# EAGLE design Rear_left_lamp (EAGLE 7.3.0)
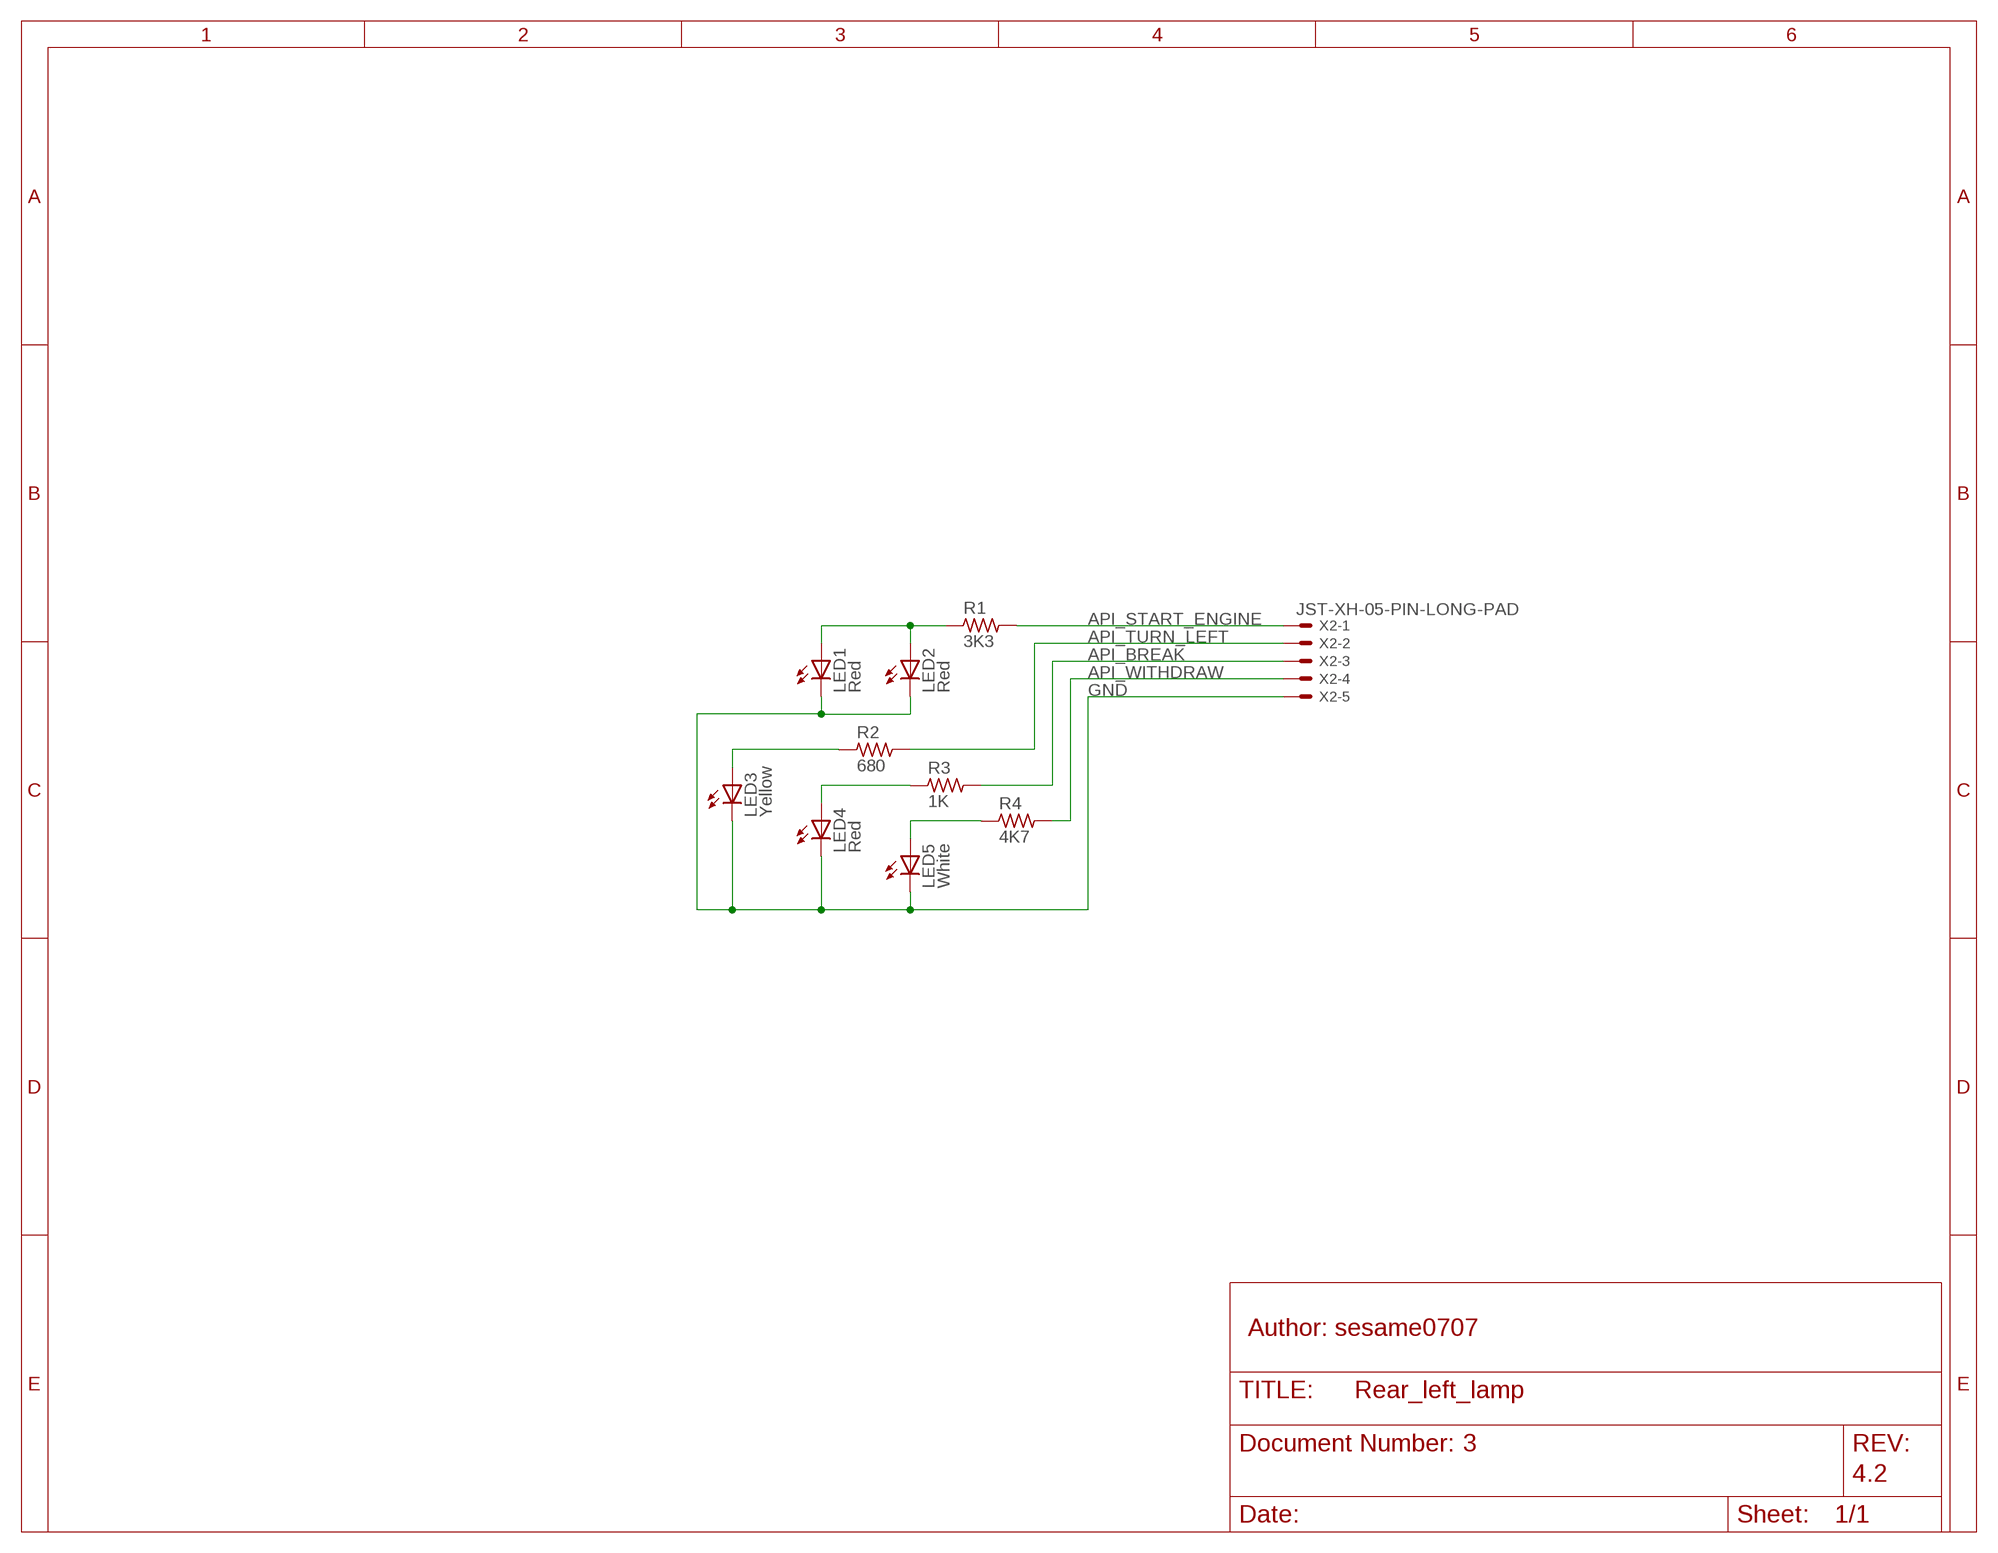
[diagram p0: schematic, sheet 1]

## Parts
LED1  Red  LED5MM  [LED5MM]
LED2  Red  LED5MM  [LED5MM]
LED3  Yellow  LED5MM  [LED5MM]
LED4  Red  LED5MM  [LED5MM]
LED5  White  LED5MM  [LED5MM]
R1  3K3  R_1206  [R1206]
R2  680  R_1206  [R1206]
R3  1K  R_1206  [R1206]
R4  4K7  R_1206  [R1206]
X2  JST-XH-05-PIN-LONG-PAD  [JST-XH-05-PACKAGE-LONG-PAD]

## Nets
API_BREAK: R3.2 X2.3
API_START_ENGINE: LED1.A LED2.A R1.1
API_TURN_LEFT: R2.2 X2.2
API_WITHDRAW: R4.2 X2.4
GND: LED1.K(C) LED2.K(C) LED3.K(C) LED4.K(C) LED5.K(C) X2.5
N$1: LED3.A R2.1
N$2: R1.2 X2.1
N$8: LED4.A R3.1
N$10: LED5.A R4.1

## Notes on the sheet
- Author: sesame0707
- 3
- 4.2

## Library data of the parts
LED1 LED2 = led:LED: LED OSRAM: - CHIPLED LG R971, LG N971, LY N971, LG Q971, LY Q971, LO R971, LY R971 LH N974, LH R974 LS Q976, LO Q976, LY Q976 LO Q996 - Hyper CHIPLED LW Q18S LB Q993, LB Q99A, LB R99A - SideLED LS A670, LO A670, LY A670, LG A670, LP A670 LB A673, LV A673, LT A673, LW A673 LH A674 LY A675 LS A676, LA A676, LO A676, LY A676, LW A676 LS A679, LY A679, LG A679 - Hyper Micro SIDELED® LS Y876, LA Y876, LO Y876, LY Y876 LT Y87S - SmartLED LW L88C, LW L88S LB L89C, LB L89S, LG L890 LS L89K, LO L89K, LY L89K LS L896, LA L896, LO L896, LY L896 - TOPLED LS T670, LO T670, LY T670, LG T670, LP T670 LSG T670, LSP T670, LSY T670, LOP T670, LYG T670 LG T671, LOG T671, LSG T671 LB T673, LV T673, LT T673, LW T673 LH T674 LS T676, LA T676, LO T676, LY T676, LB T676, LH T676, LSB T676, LW T676 LB T67C, LV T67C, LT T67C, LS T67K, LO T67K, LY T67K, LW E67C LS E67B, LA E67B, LO E67B, LY E67B, LB E67C, LV E67C, LT E67C LW T67C LS T679, LY T679, LG T679 LS T770, LO T770, LY T770, LG T770, LP T770 LB T773, LV T773, LT T773, LW T773 LH T774 LS E675, LA E675, LY E675, LS T675 LS T776, LA T776, LO T776, LY T776, LB T776 LHGB T686 LT T68C, LB T68C - Hyper Mini TOPLED® LB M676 - Mini TOPLED Santana® LG M470 LS M47K, LO M47K, LY M47K Source: http://www.osram.convergy.de LUXEON: - LUMILED® LXK2-PW12-R00, LXK2-PW12-S00, LXK2-PW14-U00, LXK2-PW14-V00 LXK2-PM12-R00, LXK2-PM12-S00, LXK2-PM14-U00 LXK2-PE12-Q00, LXK2-PE12-R00, LXK2-PE12-S00, LXK2-PE14-T00, LXK2-PE14-U00 LXK2-PB12-K00, LXK2-PB12-L00, LXK2-PB12-M00, LXK2-PB14-N00, LXK2-PB14-P00, LXK2-PB14-Q00 LXK2-PR12-L00, LXK2-PR12-M00, LXK2-PR14-Q00, LXK2-PR14-R00 LXK2-PD12-Q00, LXK2-PD12-R00, LXK2-PD12-S00 LXK2-PH12-R00, LXK2-PH12-S00 LXK2-PL12-P00, LXK2-PL12-Q00, LXK2-PL12-R00 Source: www.luxeon.com KINGBRIGHT: KA-3528ASYC Source: www.kingbright.com; COLOR: Red; CURRENT_EMPIRICAL: 0.15 mA; MANUFACTURER: LUCKYLIGHT; MANUFACTURER_PART_NUMBER: LL-503VD2E-1B; SUPPLIER: TME; SUPPLIER_PART_NUMBER: LL-503VD2E-1B; SUPPLIER_URL: https://www.tme.eu/pl/details/ll-503vd2e-1b/diody-led-tht-okragle/luckylight/; VOLTAGE_EMPIRICAL: 1.83 V
LED3 = led:LED: LED OSRAM: - CHIPLED LG R971, LG N971, LY N971, LG Q971, LY Q971, LO R971, LY R971 LH N974, LH R974 LS Q976, LO Q976, LY Q976 LO Q996 - Hyper CHIPLED LW Q18S LB Q993, LB Q99A, LB R99A - SideLED LS A670, LO A670, LY A670, LG A670, LP A670 LB A673, LV A673, LT A673, LW A673 LH A674 LY A675 LS A676, LA A676, LO A676, LY A676, LW A676 LS A679, LY A679, LG A679 - Hyper Micro SIDELED® LS Y876, LA Y876, LO Y876, LY Y876 LT Y87S - SmartLED LW L88C, LW L88S LB L89C, LB L89S, LG L890 LS L89K, LO L89K, LY L89K LS L896, LA L896, LO L896, LY L896 - TOPLED LS T670, LO T670, LY T670, LG T670, LP T670 LSG T670, LSP T670, LSY T670, LOP T670, LYG T670 LG T671, LOG T671, LSG T671 LB T673, LV T673, LT T673, LW T673 LH T674 LS T676, LA T676, LO T676, LY T676, LB T676, LH T676, LSB T676, LW T676 LB T67C, LV T67C, LT T67C, LS T67K, LO T67K, LY T67K, LW E67C LS E67B, LA E67B, LO E67B, LY E67B, LB E67C, LV E67C, LT E67C LW T67C LS T679, LY T679, LG T679 LS T770, LO T770, LY T770, LG T770, LP T770 LB T773, LV T773, LT T773, LW T773 LH T774 LS E675, LA E675, LY E675, LS T675 LS T776, LA T776, LO T776, LY T776, LB T776 LHGB T686 LT T68C, LB T68C - Hyper Mini TOPLED® LB M676 - Mini TOPLED Santana® LG M470 LS M47K, LO M47K, LY M47K Source: http://www.osram.convergy.de LUXEON: - LUMILED® LXK2-PW12-R00, LXK2-PW12-S00, LXK2-PW14-U00, LXK2-PW14-V00 LXK2-PM12-R00, LXK2-PM12-S00, LXK2-PM14-U00 LXK2-PE12-Q00, LXK2-PE12-R00, LXK2-PE12-S00, LXK2-PE14-T00, LXK2-PE14-U00 LXK2-PB12-K00, LXK2-PB12-L00, LXK2-PB12-M00, LXK2-PB14-N00, LXK2-PB14-P00, LXK2-PB14-Q00 LXK2-PR12-L00, LXK2-PR12-M00, LXK2-PR14-Q00, LXK2-PR14-R00 LXK2-PD12-Q00, LXK2-PD12-R00, LXK2-PD12-S00 LXK2-PH12-R00, LXK2-PH12-S00 LXK2-PL12-P00, LXK2-PL12-Q00, LXK2-PL12-R00 Source: www.luxeon.com KINGBRIGHT: KA-3528ASYC Source: www.kingbright.com; COLOR: Yellow; CURRENT_EMPIRICAL: 1.42 mA; MANUFACTURER: LUCKYLIGHT; MANUFACTURER_PART_NUMBER: LL-503YD2E-1B; SUPPLIER: TME; SUPPLIER_PART_NUMBER: LL-503YD2E-1B; SUPPLIER_URL: https://www.tme.eu/pl/details/ll-503yd2e-1b/diody-led-tht-okragle/luckylight/; VOLTAGE_EMPIRICAL: 1.88 V
LED4 = led:LED: LED OSRAM: - CHIPLED LG R971, LG N971, LY N971, LG Q971, LY Q971, LO R971, LY R971 LH N974, LH R974 LS Q976, LO Q976, LY Q976 LO Q996 - Hyper CHIPLED LW Q18S LB Q993, LB Q99A, LB R99A - SideLED LS A670, LO A670, LY A670, LG A670, LP A670 LB A673, LV A673, LT A673, LW A673 LH A674 LY A675 LS A676, LA A676, LO A676, LY A676, LW A676 LS A679, LY A679, LG A679 - Hyper Micro SIDELED® LS Y876, LA Y876, LO Y876, LY Y876 LT Y87S - SmartLED LW L88C, LW L88S LB L89C, LB L89S, LG L890 LS L89K, LO L89K, LY L89K LS L896, LA L896, LO L896, LY L896 - TOPLED LS T670, LO T670, LY T670, LG T670, LP T670 LSG T670, LSP T670, LSY T670, LOP T670, LYG T670 LG T671, LOG T671, LSG T671 LB T673, LV T673, LT T673, LW T673 LH T674 LS T676, LA T676, LO T676, LY T676, LB T676, LH T676, LSB T676, LW T676 LB T67C, LV T67C, LT T67C, LS T67K, LO T67K, LY T67K, LW E67C LS E67B, LA E67B, LO E67B, LY E67B, LB E67C, LV E67C, LT E67C LW T67C LS T679, LY T679, LG T679 LS T770, LO T770, LY T770, LG T770, LP T770 LB T773, LV T773, LT T773, LW T773 LH T774 LS E675, LA E675, LY E675, LS T675 LS T776, LA T776, LO T776, LY T776, LB T776 LHGB T686 LT T68C, LB T68C - Hyper Mini TOPLED® LB M676 - Mini TOPLED Santana® LG M470 LS M47K, LO M47K, LY M47K Source: http://www.osram.convergy.de LUXEON: - LUMILED® LXK2-PW12-R00, LXK2-PW12-S00, LXK2-PW14-U00, LXK2-PW14-V00 LXK2-PM12-R00, LXK2-PM12-S00, LXK2-PM14-U00 LXK2-PE12-Q00, LXK2-PE12-R00, LXK2-PE12-S00, LXK2-PE14-T00, LXK2-PE14-U00 LXK2-PB12-K00, LXK2-PB12-L00, LXK2-PB12-M00, LXK2-PB14-N00, LXK2-PB14-P00, LXK2-PB14-Q00 LXK2-PR12-L00, LXK2-PR12-M00, LXK2-PR14-Q00, LXK2-PR14-R00 LXK2-PD12-Q00, LXK2-PD12-R00, LXK2-PD12-S00 LXK2-PH12-R00, LXK2-PH12-S00 LXK2-PL12-P00, LXK2-PL12-Q00, LXK2-PL12-R00 Source: www.luxeon.com KINGBRIGHT: KA-3528ASYC Source: www.kingbright.com; COLOR: Red; CURRENT_EMPIRICAL: 1.48 mA; MANUFACTURER: LUCKYLIGHT; MANUFACTURER_PART_NUMBER: LL-503VD2E-1B; SUPPLIER: TME; SUPPLIER_PART_NUMBER: LL-503VD2E-1B; SUPPLIER_URL: https://www.tme.eu/pl/details/ll-503vd2e-1b/diody-led-tht-okragle/luckylight/; VOLTAGE_EMPIRICAL: 1.83 V
LED5 = led:LED: LED OSRAM: - CHIPLED LG R971, LG N971, LY N971, LG Q971, LY Q971, LO R971, LY R971 LH N974, LH R974 LS Q976, LO Q976, LY Q976 LO Q996 - Hyper CHIPLED LW Q18S LB Q993, LB Q99A, LB R99A - SideLED LS A670, LO A670, LY A670, LG A670, LP A670 LB A673, LV A673, LT A673, LW A673 LH A674 LY A675 LS A676, LA A676, LO A676, LY A676, LW A676 LS A679, LY A679, LG A679 - Hyper Micro SIDELED® LS Y876, LA Y876, LO Y876, LY Y876 LT Y87S - SmartLED LW L88C, LW L88S LB L89C, LB L89S, LG L890 LS L89K, LO L89K, LY L89K LS L896, LA L896, LO L896, LY L896 - TOPLED LS T670, LO T670, LY T670, LG T670, LP T670 LSG T670, LSP T670, LSY T670, LOP T670, LYG T670 LG T671, LOG T671, LSG T671 LB T673, LV T673, LT T673, LW T673 LH T674 LS T676, LA T676, LO T676, LY T676, LB T676, LH T676, LSB T676, LW T676 LB T67C, LV T67C, LT T67C, LS T67K, LO T67K, LY T67K, LW E67C LS E67B, LA E67B, LO E67B, LY E67B, LB E67C, LV E67C, LT E67C LW T67C LS T679, LY T679, LG T679 LS T770, LO T770, LY T770, LG T770, LP T770 LB T773, LV T773, LT T773, LW T773 LH T774 LS E675, LA E675, LY E675, LS T675 LS T776, LA T776, LO T776, LY T776, LB T776 LHGB T686 LT T68C, LB T68C - Hyper Mini TOPLED® LB M676 - Mini TOPLED Santana® LG M470 LS M47K, LO M47K, LY M47K Source: http://www.osram.convergy.de LUXEON: - LUMILED® LXK2-PW12-R00, LXK2-PW12-S00, LXK2-PW14-U00, LXK2-PW14-V00 LXK2-PM12-R00, LXK2-PM12-S00, LXK2-PM14-U00 LXK2-PE12-Q00, LXK2-PE12-R00, LXK2-PE12-S00, LXK2-PE14-T00, LXK2-PE14-U00 LXK2-PB12-K00, LXK2-PB12-L00, LXK2-PB12-M00, LXK2-PB14-N00, LXK2-PB14-P00, LXK2-PB14-Q00 LXK2-PR12-L00, LXK2-PR12-M00, LXK2-PR14-Q00, LXK2-PR14-R00 LXK2-PD12-Q00, LXK2-PD12-R00, LXK2-PD12-S00 LXK2-PH12-R00, LXK2-PH12-S00 LXK2-PL12-P00, LXK2-PL12-Q00, LXK2-PL12-R00 Source: www.luxeon.com KINGBRIGHT: KA-3528ASYC Source: www.kingbright.com; COLOR: White; CURRENT_EMPIRICAL: 0.14 mA; MANUFACTURER: LUCKYLIGHT; MANUFACTURER_PART_NUMBER: LL-504WC2V-W2-3PD; SUPPLIER: TME; SUPPLIER_PART_NUMBER: LL-504WC2V-W2-3PD; SUPPLIER_URL: https://www.tme.eu/pl/details/ll-504wc2v-w2-3pd/diody-led-tht-okragle/luckylight/; VOLTAGE_EMPIRICAL: 2.58 V
R1 = rc-master-smd:R_: RESISTOR; MANUFACTURER: ROYAL OHM; MANUFACTURER_PART_NUMBER: 1206S4J0332T5E; RESISTANCE: 3.3 kOhm; SUPPLIER: TME; SUPPLIER_PART_NUMBER: 1206S4J0332T5E; SUPPLIER_URL: https://www.tme.eu/pl/details/1206s4j0332t5e/rezystory-smd/royal-ohm/
R2 = rc-master-smd:R_: RESISTOR; MANUFACTURER: ROYAL OHM; MANUFACTURER_PART_NUMBER: 1206S4J0681T5E; RESISTANCE: 680 Ohm; SUPPLIER: TME; SUPPLIER_PART_NUMBER: 1206S4J0681T5E; SUPPLIER_URL: https://www.tme.eu/pl/details/1206s4j0681t5e/rezystory-smd/royal-ohm/
R3 = rc-master-smd:R_: RESISTOR; MANUFACTURER: ROYAL OHM; MANUFACTURER_PART_NUMBER: 1206S4J0102T5E; RESISTANCE: 1 kOhm; SUPPLIER: TME; SUPPLIER_PART_NUMBER: 1206S4J0102T5E; SUPPLIER_URL: https://www.tme.eu/pl/details/1206s4j0102t5e/rezystory-smd/royal-ohm/
R4 = rc-master-smd:R_: RESISTOR; MANUFACTURER: ROYAL OHM; MANUFACTURER_PART_NUMBER: 1206S4J0472T5E; RESISTANCE: 4.7 kOhm; SUPPLIER: TME; SUPPLIER_PART_NUMBER: 1206S4J0472T5E; SUPPLIER_URL: https://www.tme.eu/pl/details/1206s4j0472t5e/rezystory-smd/royal-ohm/
X2 = Rembrandt Electronics - JST XH Connectors v1-0:JST-XH-05-PIN: JST XH Connector 2 Pin Wire to board connector. Pitch: 2,54 mm, (0.100") Number of pins: 5 Created by Rembrandt Electronics www.rembrandtelectronics.com

## Board
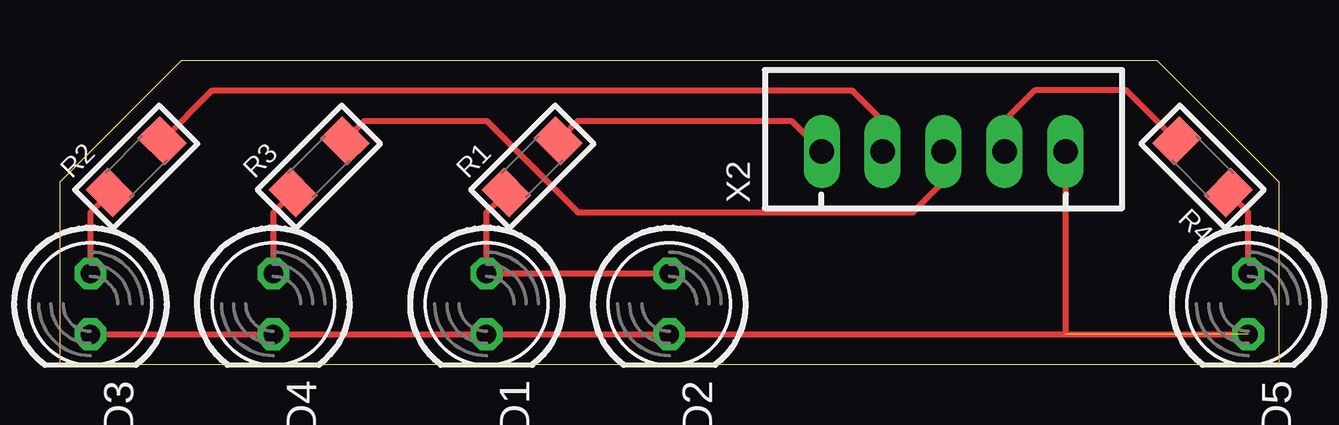
[diagram p1: board, top side]

Size 50.8 x 12.7 mm. Coordinates in mm from the lower left corner, seen from the top.
Outline: 0,0 0,7.62 5.08,12.7 45.72,12.7 50.8,7.62 50.8,0 0,0
Copper layers (1*16): Top 0.035mm / dielectric 1.5mm / Bottom 0.035mm
Design rules "default": minimum track width 10mil, minimum drill 24mil, track to track 8mil, track to pad 8mil, pad to pad 8mil, via to via 8mil, smd to smd 8mil, copper to edge 40mil, drill to drill 8mil, minimum pad ring 10mil, minimum via ring 8mil, stop-mask expansion 4mil, vias tented up to drill 0mil, thermal gap 10mil

### Footprints (pad centres in the part's own frame; a part is rotated, then mirrored left to right if it is on the bottom)
LED5MM = drill 0.813 octagon: A -1.27,0; K 1.27,0
R1206 = smd 1.3 x 1.6: 1 -1.524,0; 2 1.524,0
JST-XH-05-PACKAGE-LONG-PAD = drill 1.016 long: 1 -5.08,0; 2 -2.54,0; 3 0,0; 4 2.54,0; 5 5.08,0

### Placement (x,y rotation side)
LED1  17.78,2.54 270 top
LED2  25.4,2.54 270 top
LED3  1.27,2.54 270 top
LED4  8.89,2.54 270 top
LED5  49.53,2.54 270 top
R1  19.68,8.26 45 top
R2  3.17,8.26 45 top
R3  10.79,8.26 45 top
R4  47.62,8.26 135 top
X2  36.83,8.89 0 top

### Tracks (layer width: path | path; a pad name or v marks a point on that pad's centre or on a via)
API_BREAK
  Top 0.254: X2.3 36.83,7.62 35.56,6.35 21.59,6.35 17.78,10.16 12.7,10.16 R3.2
API_START_ENGINE
  Top 0.254: LED2.A LED1.A 17.78,6.35 R1.1
API_TURN_LEFT
  Top 0.254: X2.2 34.29,10.16 33.02,11.43 6.35,11.43 R2.2
API_WITHDRAW
  Top 0.254: X2.4 39.37,10.16 40.64,11.43 44.45,11.43 R4.2
GND  (1 unrouted)
  Top 0.254: 41.91,1.27 LED2.K LED1.K LED4.K LED3.K | 41.91,1.27 LED5.K | X2.5 41.91,1.27
N$1
  Top 0.254: R2.1 1.27,6.35 LED3.A
N$2
  Top 0.254: X2.1 30.48,10.16 21.59,10.16 R1.2
N$8
  Top 0.254: R3.1 8.89,6.35 LED4.A
N$10
  Top 0.254: LED5.A 49.53,6.35 R4.1